# Altium project PCB_Project.PrjPcb
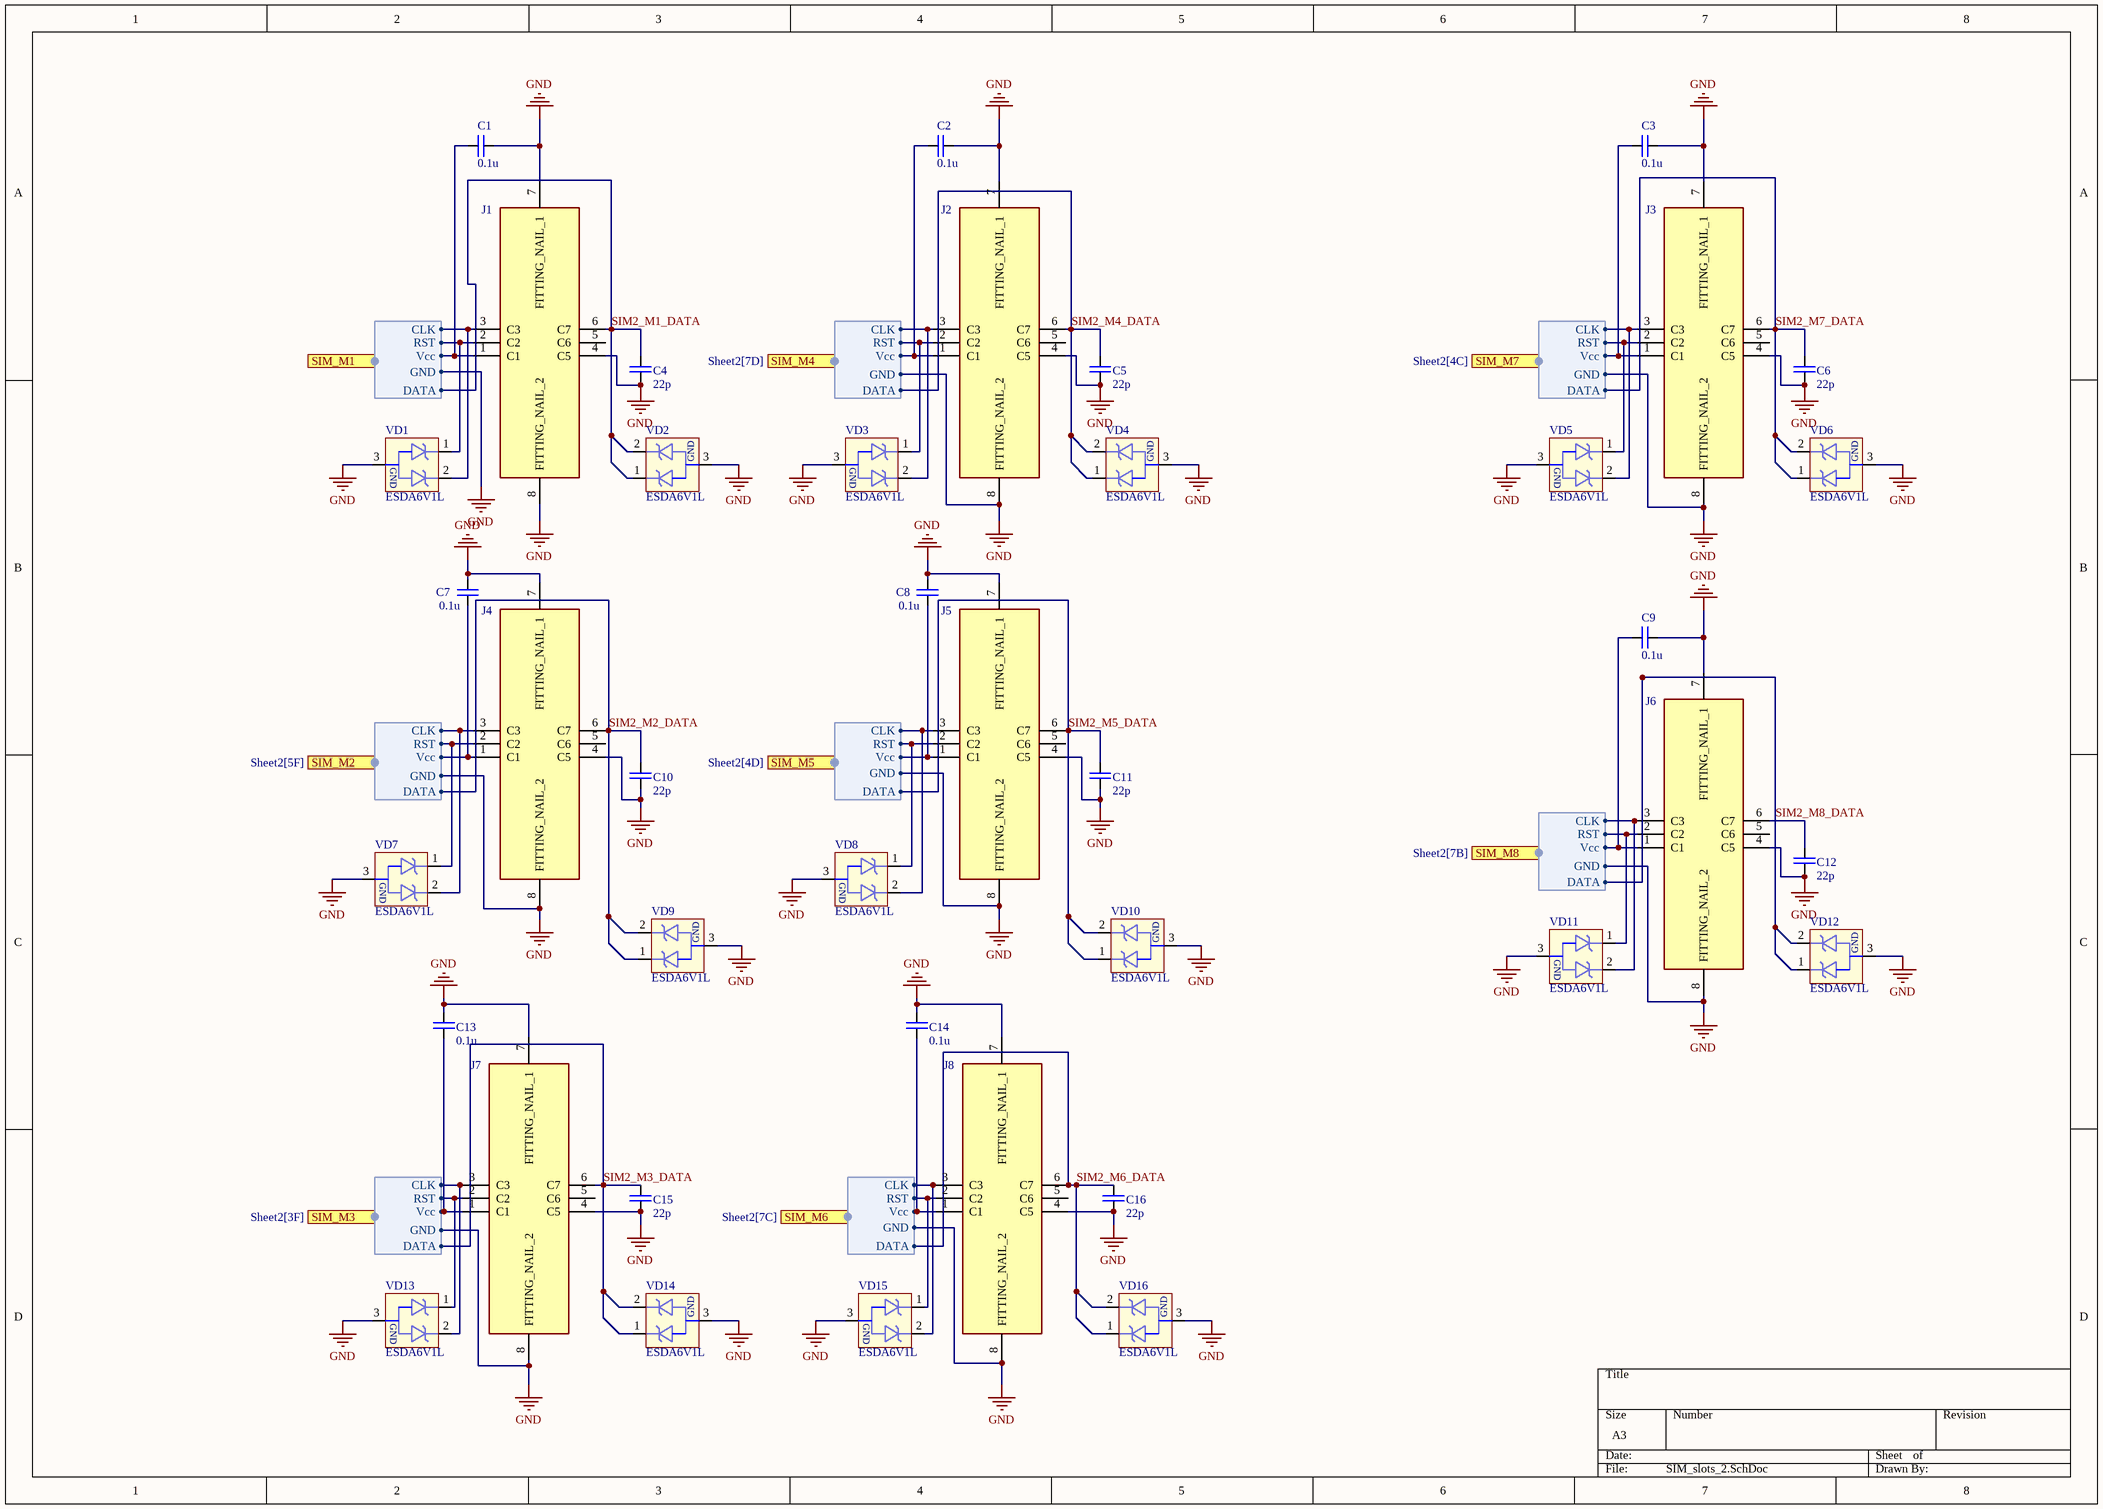
[diagram p0: SIM_slots_2.SchDoc]
2 sheets, 44 parts. Net scope: flat (ports and power ports of the same name join across sheets).
Board file: PCB1.PcbDoc
Sheets:
  SIM_slots_2.SchDoc
  Sheet2.SchDoc

## Sheet SIM_slots_2.SchDoc
size A3; SheetNumber: 1; SheetTotal: 2

### Parts
C1  value 0.1u  [C0402]  (hidden comment: Конденсатор SMD, 0.1мкФ, X7R, 25В, 10%, 0402)
C2  value 0.1u  [C0402]  (hidden comment: Конденсатор SMD, 0.1мкФ, X7R, 25В, 10%, 0402)
C3  value 0.1u  [C0402]  (hidden comment: Конденсатор SMD, 0.1мкФ, X7R, 25В, 10%, 0402)
C4  value 22p  [C0402]  (hidden comment: Конденсатор SMD, 22пФ, X7R, 50В, 10%, 0402)
C5  value 22p  [C0402]  (hidden comment: Конденсатор SMD, 22пФ, X7R, 50В, 10%, 0402)
C6  value 22p  [C0402]  (hidden comment: Конденсатор SMD, 22пФ, X7R, 50В, 10%, 0402)
C7  value 0.1u  [C0402]  (hidden comment: Конденсатор SMD, 0.1мкФ, X7R, 25В, 10%, 0402)
C8  value 0.1u  [C0402]  (hidden comment: Конденсатор SMD, 0.1мкФ, X7R, 25В, 10%, 0402)
C9  value 0.1u  [C0402]  (hidden comment: Конденсатор SMD, 0.1мкФ, X7R, 25В, 10%, 0402)
C10  value 22p  [C0402]  (hidden comment: Конденсатор SMD, 22пФ, X7R, 50В, 10%, 0402)
C11  value 22p  [C0402]  (hidden comment: Конденсатор SMD, 22пФ, X7R, 50В, 10%, 0402)
C12  value 22p  [C0402]  (hidden comment: Конденсатор SMD, 22пФ, X7R, 50В, 10%, 0402)
C13  value 0.1u  [C0402]  (hidden comment: Конденсатор SMD, 0.1мкФ, X7R, 25В, 10%, 0402)
C14  value 0.1u  [C0402]  (hidden comment: Конденсатор SMD, 0.1мкФ, X7R, 25В, 10%, 0402)
C15  value 22p  [C0402]  (hidden comment: Конденсатор SMD, 22пФ, X7R, 50В, 10%, 0402)
C16  value 22p  [C0402]  (hidden comment: Конденсатор SMD, 22пФ, X7R, 50В, 10%, 0402)
J1  47388-2001  [473882001]  (value not drawn)
J2  47388-2001  [473882001]  (value not drawn)
J3  47388-2001  [473882001]  (value not drawn)
J4  47388-2001  [473882001]  (value not drawn)
J5  47388-2001  [473882001]  (value not drawn)
J6  47388-2001  [473882001]  (value not drawn)
J7  47388-2001  [473882001]  (value not drawn)
J8  47388-2001  [473882001]  (value not drawn)
VD1  Диод защитный, ESDA6V1L  [SOT23-3L]  (value not drawn)
VD2  Диод защитный, ESDA6V1L  [SOT23-3L]  (value not drawn)
VD3  Диод защитный, ESDA6V1L  [SOT23-3L]  (value not drawn)
VD4  Диод защитный, ESDA6V1L  [SOT23-3L]  (value not drawn)
VD5  Диод защитный, ESDA6V1L  [SOT23-3L]  (value not drawn)
VD6  Диод защитный, ESDA6V1L  [SOT23-3L]  (value not drawn)
VD7  Диод защитный, ESDA6V1L  [SOT23-3L]  (value not drawn)
VD8  Диод защитный, ESDA6V1L  [SOT23-3L]  (value not drawn)
VD9  Диод защитный, ESDA6V1L  [SOT23-3L]  (value not drawn)
VD10  Диод защитный, ESDA6V1L  [SOT23-3L]  (value not drawn)
VD11  Диод защитный, ESDA6V1L  [SOT23-3L]  (value not drawn)
VD12  Диод защитный, ESDA6V1L  [SOT23-3L]  (value not drawn)
VD13  Диод защитный, ESDA6V1L  [SOT23-3L]  (value not drawn)
VD14  Диод защитный, ESDA6V1L  [SOT23-3L]  (value not drawn)
VD15  Диод защитный, ESDA6V1L  [SOT23-3L]  (value not drawn)
VD16  Диод защитный, ESDA6V1L  [SOT23-3L]  (value not drawn)

### Ports
SIM_M1 (harness SIM_m1, see Sheet2[7E]), SIM_M2 (harness SIM_2, see Sheet2[5F]), SIM_M3 (harness SIM_M3, see Sheet2[3F]), SIM_M4 (harness SIM_4, see Sheet2[7D]), SIM_M5 (harness SIM_5, see Sheet2[4D]), SIM_M6 (harness SIM_6, see Sheet2[7C]), SIM_M7 (harness SIM_M7, see Sheet2[4C]), SIM_M8 (harness SIM, see Sheet2[7B])

### Harnesses
SIM_m1: Vcc, RST, CLK, DATA, GND
SIM_2: Vcc, RST, CLK, DATA, GND
SIM_M3: Vcc, RST, CLK, DATA, GND
SIM_4: Vcc, RST, CLK, DATA, GND
SIM_5: Vcc, RST, CLK, DATA, GND
SIM_6: Vcc, RST, CLK, DATA, GND
SIM_M7: Vcc, RST, CLK, DATA, GND
SIM: Vcc, RST, CLK, DATA, GND

### Nets
GND: C1.2 C2.2 C3.2 C4.1 C5.1 C6.1 C7.2 C8.2 C9.2 C10.1 C11.1 C12.1 C13.2 C14.2 C15.1 C16.1 J1.4(C5) J1.7(FITTING_NAIL_1) J1.8(FITTING_NAIL_2) J2.4(C5) J2.7(FITTING_NAIL_1) J2.8(FITTING_NAIL_2) J3.4(C5) J3.7(FITTING_NAIL_1) J3.8(FITTING_NAIL_2) J4.4(C5) J4.7(FITTING_NAIL_1) J4.8(FITTING_NAIL_2) J5.4(C5) J5.7(FITTING_NAIL_1) J5.8(FITTING_NAIL_2) J6.4(C5) J6.7(FITTING_NAIL_1) J6.8(FITTING_NAIL_2) J7.4(C5) J7.7(FITTING_NAIL_1) J7.8(FITTING_NAIL_2) J8.4(C5) J8.7(FITTING_NAIL_1) J8.8(FITTING_NAIL_2) VD1.3(GND) VD2.3(GND) VD3.3(GND) VD4.3(GND) VD5.3(GND) VD6.3(GND) VD7.3(GND) VD8.3(GND) VD9.3(GND) VD10.3(GND) VD11.3(GND) VD12.3(GND) VD13.3(GND) VD14.3(GND) VD15.3(GND) VD16.3(GND) ; port SIM_M1.GND, port SIM_M2.GND, port SIM_M3.GND, port SIM_M4.GND, port SIM_M5.GND, port SIM_M6.GND, port SIM_M7.GND, port SIM_M8.GND
SIM2_M1_DATA: C4.2 J1.6(C7) VD2.1 VD2.2 ; port SIM_M1.DATA
SIM2_M2_DATA: C10.2 J4.6(C7) VD9.1 VD9.2 ; port SIM_M2.DATA
SIM2_M3_DATA: C15.2 J7.6(C7) VD14.1 VD14.2 ; port SIM_M3.DATA
SIM2_M4_DATA: C5.2 J2.6(C7) VD4.1 VD4.2 ; port SIM_M4.DATA
SIM2_M5_DATA: C11.2 J5.6(C7) VD10.1 VD10.2 ; port SIM_M5.DATA
SIM2_M6_DATA: C16.2 J8.6(C7) VD16.1 VD16.2 ; port SIM_M6.DATA
SIM2_M7_DATA: C6.2 J3.6(C7) VD6.1 VD6.2 ; port SIM_M7.DATA
SIM2_M8_DATA: C12.2 J6.6(C7) VD12.1 VD12.2 ; port SIM_M8.DATA
NetC1_1: C1.1 C7.1 J1.1(C1) J4.1(C1) ; port SIM_M1.Vcc, port SIM_M2.Vcc
NetC2_1: C2.1 C13.1 J2.1(C1) J7.1(C1) ; port SIM_M3.Vcc, port SIM_M4.Vcc
NetC3_1: C3.1 C9.1 J3.1(C1) J6.1(C1) ; port SIM_M7.Vcc, port SIM_M8.Vcc
NetC8_1: C8.1 C14.1 J5.1(C1) J8.1(C1) ; port SIM_M5.Vcc, port SIM_M6.Vcc
NetJ1_2: J1.2(C2) VD1.1 ; port SIM_M1.RST
NetJ1_3: J1.3(C3) VD1.2 ; port SIM_M1.CLK
NetJ2_2: J2.2(C2) VD3.1 ; port SIM_M4.RST
NetJ2_3: J2.3(C3) VD3.2 ; port SIM_M4.CLK
NetJ3_2: J3.2(C2) VD5.1 ; port SIM_M7.RST
NetJ3_3: J3.3(C3) VD5.2 ; port SIM_M7.CLK
NetJ4_2: J4.2(C2) VD7.1 ; port SIM_M2.RST
NetJ4_3: J4.3(C3) VD7.2 ; port SIM_M2.CLK
NetJ5_2: J5.2(C2) VD8.1 ; port SIM_M5.RST
NetJ5_3: J5.3(C3) VD8.2 ; port SIM_M5.CLK
NetJ6_2: J6.2(C2) VD11.1 ; port SIM_M8.RST
NetJ6_3: J6.3(C3) VD11.2 ; port SIM_M8.CLK
NetJ7_2: J7.2(C2) VD13.1 ; port SIM_M3.RST
NetJ7_3: J7.3(C3) VD13.2 ; port SIM_M3.CLK
NetJ8_2: J8.2(C2) VD15.1 ; port SIM_M6.RST
NetJ8_3: J8.3(C3) VD15.2 ; port SIM_M6.CLK

Not connected (* = marked no-connect by the designer): J1 5(C6); J2 5(C6); J3 5(C6); J4 5(C6); J5 5(C6); J6 5(C6); J7 5(C6); J8 5(C6)

### Library data of the parts
C1-C3 C7-C9 C13 C14 = C0402: Chip Capacitor 0402; Assembly: 0.1u_X7R_25V_10%_0402; Voltage_assembly: 25V; Tolerance: 10%; Voltage: 25В; TemperatureCoeff: X7R; Family: Конденсатор SMD; Capacitance: 0.1мкФ; Package: 0402
C4-C6 C10-C12 C15 C16 = C0402: Chip Capacitor 0402; Assembly: 22p_X7R_50V_10%_0402; Voltage_assembly: 50V; Tolerance: 10%; Voltage: 50В; TemperatureCoeff: X7R; Family: Конденсатор SMD; Capacitance: 22пФ; Package: 0402
J1-J8 = 47388-2001: Connector; Manufacturer_Name: Molex; Datasheet Link: https://www.molex.com/webdocs/datasheets/pdf/en-us/0473882001_MEMORY_CARD_SOCKET.pdf; Height: 1mm; Manufacturer_Part_Number: 47388-2001; Arrow Part Number: 47388-2001; Arrow Price/Stock: https://www.arrow.com/en/products/47388-2001/molex; Mouser Part Number: 538-47388-2001; Mouser Price/Stock: https://www.mouser.co.uk/ProductDetail/Molex/47388-2001?qs=KKUMDL8WE1K2q3cPEOwmLw%3D%3D
VD1-VD16 = ESDA6V1L: Dual diode array for ESD protection; Manufacturer: STMicroelectronics; Family: Диод защитный; Package: SOT23; Assembly: ESDA6V1L; PartNumber: ESDA6V1L

## Sheet Sheet2.SchDoc
size 431 x 279 mm; Organization: ORGANIZATION; Address1: ADDRESS 1; Address2: ADDRESS 2; Address3: ADDRESS 3; Address4: ADDRESS 4; Revision: -; SheetNumber: 2; SheetTotal: 2; ENG_APP_DATE: --/--/--; DSN_APP_DATE: --/--/--; CHK_APP_DATE: --/--/--
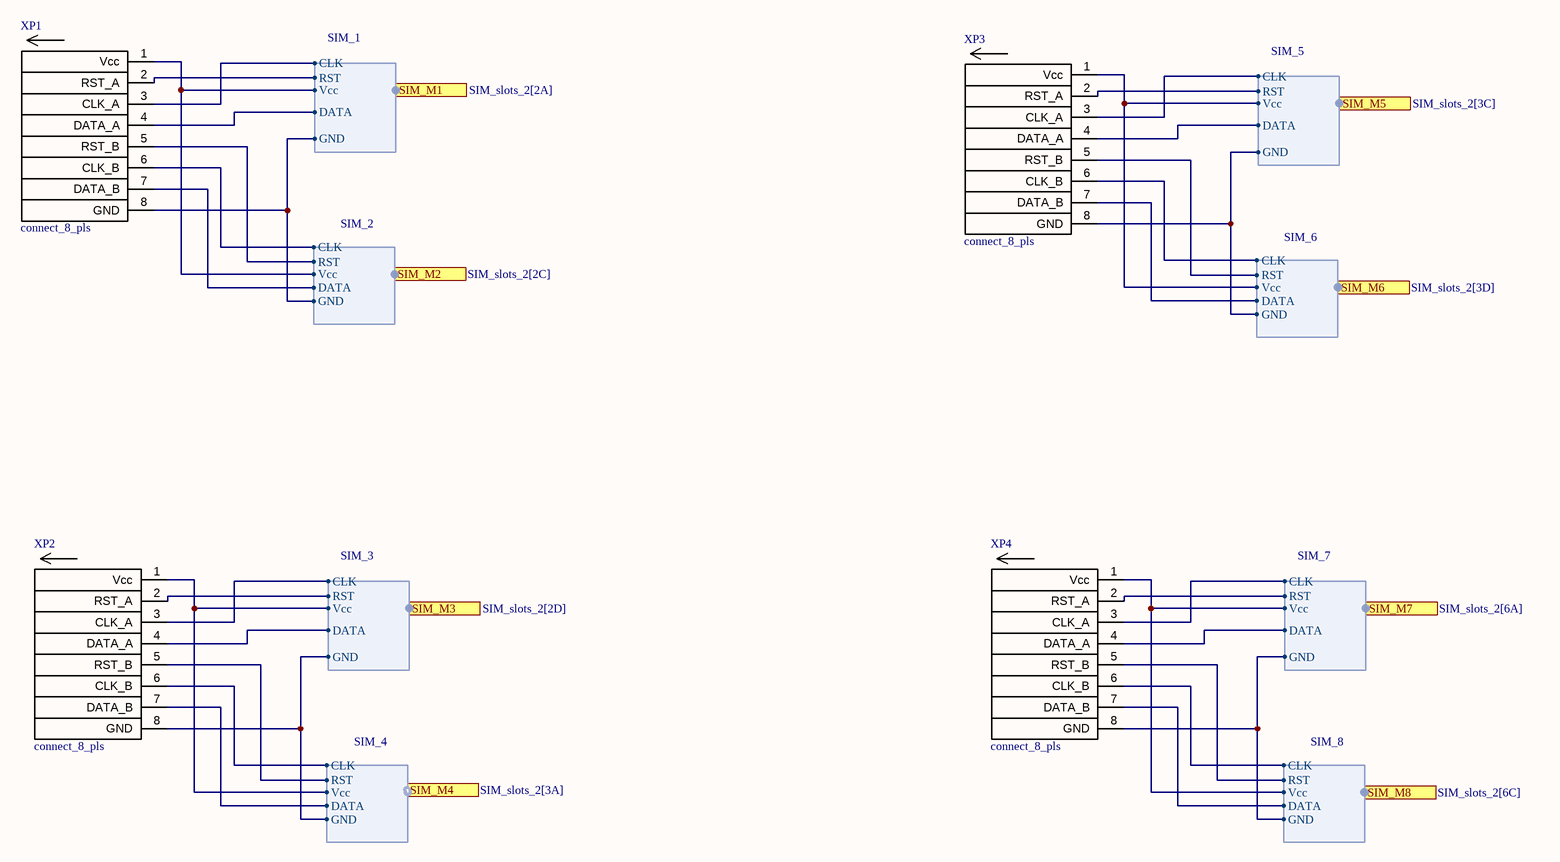
[diagram p1: Sheet2.SchDoc]

### Parts
XP1  connect_8_pls  [PLS-8]
XP2  connect_8_pls  [PLS-8]
XP3  connect_8_pls  [PLS-8]
XP4  connect_8_pls  [PLS-8]

### Ports
SIM_M1 (harness SIM_1, see SIM_slots_2[2A]), SIM_M2 (harness SIM_2, see SIM_slots_2[2C]), SIM_M3 (harness SIM_3, see SIM_slots_2[2D]), SIM_M4 (harness SIM_4, see SIM_slots_2[3A]), SIM_M5 (harness SIM_5, see SIM_slots_2[3C]), SIM_M6 (harness SIM_6, see SIM_slots_2[3D]), SIM_M7 (harness SIM_7, see SIM_slots_2[6A]), SIM_M8 (harness SIM_8, see SIM_slots_2[6C])

### Harnesses
SIM_1: CLK, RST, Vcc, DATA, GND
SIM_2: CLK, RST, Vcc, DATA, GND
SIM_3: CLK, RST, Vcc, DATA, GND
SIM_4: CLK, RST, Vcc, DATA, GND
SIM_5: CLK, RST, Vcc, DATA, GND
SIM_6: CLK, RST, Vcc, DATA, GND
SIM_7: CLK, RST, Vcc, DATA, GND
SIM_8: CLK, RST, Vcc, DATA, GND

### Nets
GND: XP1.8(GND) XP2.8(GND) XP3.8(GND) XP4.8(GND) ; port SIM_M1.GND, port SIM_M2.GND, port SIM_M3.GND, port SIM_M4.GND, port SIM_M5.GND, port SIM_M6.GND, port SIM_M7.GND, port SIM_M8.GND
SIM2_M1_DATA: XP1.4(DATA_A) ; port SIM_M1.DATA
SIM2_M2_DATA: XP1.7(DATA_B) ; port SIM_M2.DATA
SIM2_M3_DATA: XP2.4(DATA_A) ; port SIM_M3.DATA
SIM2_M4_DATA: XP2.7(DATA_B) ; port SIM_M4.DATA
SIM2_M5_DATA: XP3.4(DATA_A) ; port SIM_M5.DATA
SIM2_M6_DATA: XP3.7(DATA_B) ; port SIM_M6.DATA
SIM2_M7_DATA: XP4.4(DATA_A) ; port SIM_M7.DATA
SIM2_M8_DATA: XP4.7(DATA_B) ; port SIM_M8.DATA
NetC1_1: XP1.1(Vcc) ; port SIM_M1.Vcc, port SIM_M2.Vcc
NetC2_1: XP2.1(Vcc) ; port SIM_M3.Vcc, port SIM_M4.Vcc
NetC3_1: XP4.1(Vcc) ; port SIM_M7.Vcc, port SIM_M8.Vcc
NetC8_1: XP3.1(Vcc) ; port SIM_M5.Vcc, port SIM_M6.Vcc
NetJ1_2: XP1.2(RST_A) ; port SIM_M1.RST
NetJ1_3: XP1.3(CLK_A) ; port SIM_M1.CLK
NetJ2_2: XP2.5(RST_B) ; port SIM_M4.RST
NetJ2_3: XP2.6(CLK_B) ; port SIM_M4.CLK
NetJ3_2: XP4.2(RST_A) ; port SIM_M7.RST
NetJ3_3: XP4.3(CLK_A) ; port SIM_M7.CLK
NetJ4_2: XP1.5(RST_B) ; port SIM_M2.RST
NetJ4_3: XP1.6(CLK_B) ; port SIM_M2.CLK
NetJ5_2: XP3.2(RST_A) ; port SIM_M5.RST
NetJ5_3: XP3.3(CLK_A) ; port SIM_M5.CLK
NetJ6_2: XP4.5(RST_B) ; port SIM_M8.RST
NetJ6_3: XP4.6(CLK_B) ; port SIM_M8.CLK
NetJ7_2: XP2.2(RST_A) ; port SIM_M3.RST
NetJ7_3: XP2.3(CLK_A) ; port SIM_M3.CLK
NetJ8_2: XP3.5(RST_B) ; port SIM_M6.RST
NetJ8_3: XP3.6(CLK_B) ; port SIM_M6.CLK

### Notes on the sheet
- DWG. NO.
- REV.
- SHT.
- THIS DOCUMENT AND THE DATA DISCLOSED HEREIN OR HEREWITH IS THE PROPERTY OF ALTIUM LIMITED AND MAY BE FREELY DISTRIBUTED IN WHOLE. NO RIGHTS ARE RESERVED OR EXPRESS OR IMPLIED WARANTEE GIVEN.
- REVISION
- DESCRIPTION
- DATE
- APPROVED
- ENG:
- APPROVALS
- PROJECT
- DSN:
- CHK:
- REFERENCE DOCUMENTS
- PROJECT REVISION:
- TITLE
- DOCUMENT REVISION:
- DESIGN ITEM:
- BOM:
- FAB DWG:
- PCB DWG:
- ASSY DWG:
- SCALE:
- SIZE
- B
- CAGE CODE
- FILE NAME
- DWG NO.
- SHEET
- OF
- REV

### Library data of the parts
XP1-XP4 = connect_8_pls: PLS-8 (DS1021-1x8); ManufacturerName: Connfly; System: Connector; Assembly: PLS-8 (DS1021-1x8); PartNumber: PLS-8 (DS1021-1x8)

## Nets that join several sheets
GND: SIM_slots_2 (56 pins), Sheet2 (XP1.8 XP2.8 XP3.8 XP4.8)
NetC1_1: SIM_slots_2 (C1.1 C7.1 J1.1 J4.1), Sheet2 (XP1.1)
NetC2_1: SIM_slots_2 (C2.1 C13.1 J2.1 J7.1), Sheet2 (XP2.1)
NetC3_1: SIM_slots_2 (C3.1 C9.1 J3.1 J6.1), Sheet2 (XP4.1)
NetC8_1: SIM_slots_2 (C8.1 C14.1 J5.1 J8.1), Sheet2 (XP3.1)
NetJ1_2: SIM_slots_2 (J1.2 VD1.1), Sheet2 (XP1.2)
NetJ1_3: SIM_slots_2 (J1.3 VD1.2), Sheet2 (XP1.3)
NetJ2_2: SIM_slots_2 (J2.2 VD3.1), Sheet2 (XP2.5)
NetJ2_3: SIM_slots_2 (J2.3 VD3.2), Sheet2 (XP2.6)
NetJ3_2: SIM_slots_2 (J3.2 VD5.1), Sheet2 (XP4.2)
NetJ3_3: SIM_slots_2 (J3.3 VD5.2), Sheet2 (XP4.3)
NetJ4_2: SIM_slots_2 (J4.2 VD7.1), Sheet2 (XP1.5)
NetJ4_3: SIM_slots_2 (J4.3 VD7.2), Sheet2 (XP1.6)
NetJ5_2: SIM_slots_2 (J5.2 VD8.1), Sheet2 (XP3.2)
NetJ5_3: SIM_slots_2 (J5.3 VD8.2), Sheet2 (XP3.3)
NetJ6_2: SIM_slots_2 (J6.2 VD11.1), Sheet2 (XP4.5)
NetJ6_3: SIM_slots_2 (J6.3 VD11.2), Sheet2 (XP4.6)
NetJ7_2: SIM_slots_2 (J7.2 VD13.1), Sheet2 (XP2.2)
NetJ7_3: SIM_slots_2 (J7.3 VD13.2), Sheet2 (XP2.3)
NetJ8_2: SIM_slots_2 (J8.2 VD15.1), Sheet2 (XP3.5)
NetJ8_3: SIM_slots_2 (J8.3 VD15.2), Sheet2 (XP3.6)
SIM2_M1_DATA: SIM_slots_2 (C4.2 J1.6 VD2.1 VD2.2), Sheet2 (XP1.4)
SIM2_M2_DATA: SIM_slots_2 (C10.2 J4.6 VD9.1 VD9.2), Sheet2 (XP1.7)
SIM2_M3_DATA: SIM_slots_2 (C15.2 J7.6 VD14.1 VD14.2), Sheet2 (XP2.4)
SIM2_M4_DATA: SIM_slots_2 (C5.2 J2.6 VD4.1 VD4.2), Sheet2 (XP2.7)
SIM2_M5_DATA: SIM_slots_2 (C11.2 J5.6 VD10.1 VD10.2), Sheet2 (XP3.4)
SIM2_M6_DATA: SIM_slots_2 (C16.2 J8.6 VD16.1 VD16.2), Sheet2 (XP3.7)
SIM2_M7_DATA: SIM_slots_2 (C6.2 J3.6 VD6.1 VD6.2), Sheet2 (XP4.4)
SIM2_M8_DATA: SIM_slots_2 (C12.2 J6.6 VD12.1 VD12.2), Sheet2 (XP4.7)